# Altium schematic sheet VDMEDA_7SegDisp.SchDoc
size A4
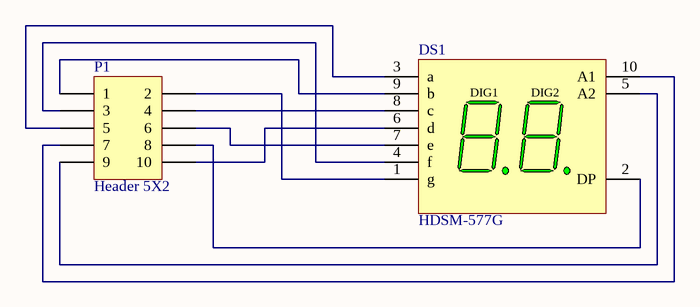
[diagram p0: VDMEDA_7SegDisp.SchDoc]

## Parts
DS1  HDSM-577G  [HDSM-577]
P1  Header 5X2  [HDR2X5]

## Nets
NetDS1_1: DS1.1(g) P1.2
NetDS1_2: DS1.2(DP) P1.8
NetDS1_3: DS1.3(a) P1.5
NetDS1_4: DS1.4(f) P1.3
NetDS1_5: DS1.5(A2) P1.9
NetDS1_6: DS1.6(d) P1.10
NetDS1_7: DS1.7(e) P1.6
NetDS1_8: DS1.8(c) P1.4
NetDS1_9: DS1.9(b) P1.1
NetDS1_10: DS1.10(A1) P1.7

## Notes on the sheet
- (in symbol HDSM-577G) DIG1; DIG2

## Library data of the parts
DS1 = HDSM-577G: 9.2 mm Green 7-Segment Display: 2-Digit, RH DP; LuminousIntensity: 1100 ucd (Minimum).; Published: 26-May-2004; LatestRevisionDate: 11-Oct-2004; LatestRevisionNote: Display outline superimposed on PCB Footprint.; DatasheetDocument: 14-Mar-2003; PackageDocument: 14-Mar-2003; PackageReference: HDSM-577; Publisher: Altium Limited; LED_Colour: Green; ComponentLink1Description: Manufacturer Link; ComponentLink1URL: http://www.agilent.com/
P1 = Header 5X2: Header, 5-Pin, Dual row; LatestRevisionDate: 17-Jul-2002; LatestRevisionNote: Re-released for DXP Platform.; Publisher: Altium Limited